# Altium schematic sheet [03] LCD.SchDoc
size A
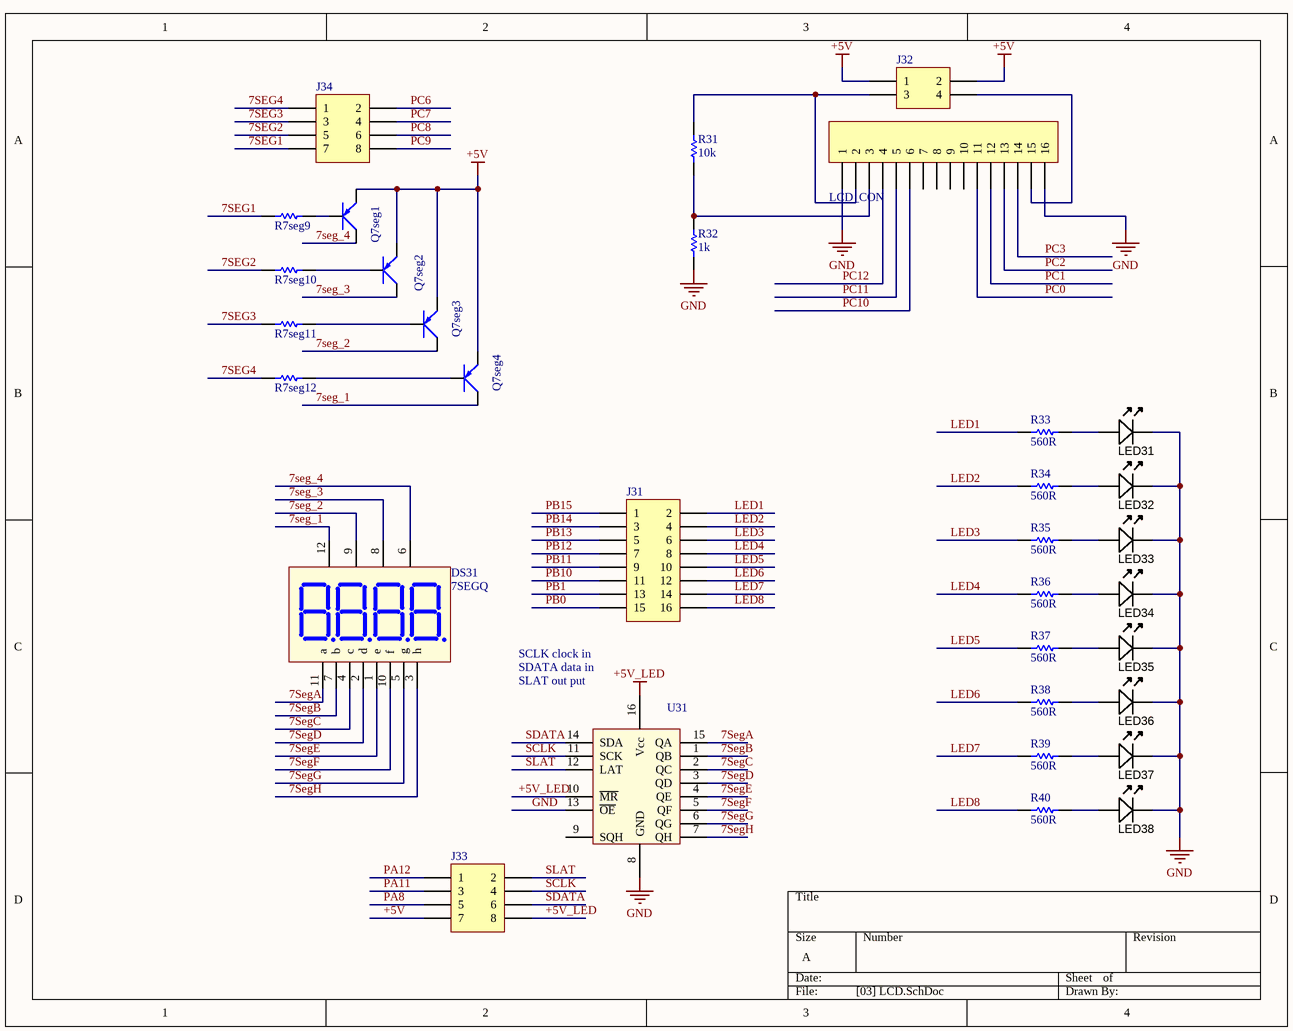
[diagram p0: [03] LCD.SchDoc]

## Parts
DS31  7SEGQ  [7segx4_small]
J31  Header 8X2  [HDR2X8]  (value not drawn)
J32  Header 2X2  [HDR2X2]  (value not drawn)
J33  Header 4X2  [HDR2X4]  (value not drawn)
J34  Header 4X2  [HDR2X4]  (value not drawn)
LCD_CON  Header 16  [HDR1X16]  (value not drawn)
LED31  Blue  [LED-0805-K]  (value not drawn)
LED32  Blue  [LED-0805-K]  (value not drawn)
LED33  Blue  [LED-0805-K]  (value not drawn)
LED34  Blue  [LED-0805-K]  (value not drawn)
LED35  Blue  [LED-0805-K]  (value not drawn)
LED36  Blue  [LED-0805-K]  (value not drawn)
LED37  Blue  [LED-0805-K]  (value not drawn)
LED38  Blue  [LED-0805-K]  (value not drawn)
Q7seg1  A1015  [SOT23B]  (value not drawn)
Q7seg2  A1015  [SOT23B]  (value not drawn)
Q7seg3  A1015  [SOT23B]  (value not drawn)
Q7seg4  A1015  [SOT23B]  (value not drawn)
R7seg9  Res  [RESC1608N_ZERO]  (value not drawn)
R7seg10  Res  [RESC1608N_ZERO]  (value not drawn)
R7seg11  Res  [RESC1608N_ZERO]  (value not drawn)
R7seg12  Res  [RESC1608N_ZERO]  (value not drawn)
R31  value 10k  [RESC1608N_ZERO]  (hidden comment: Res)
R32  value 1k  [RESC1608N_ZERO]  (hidden comment: Res)
R33  value 560R  [RESC1608N_ZERO]  (hidden comment: Res)
R34  value 560R  [RESC1608N_ZERO]  (hidden comment: Res)
R35  value 560R  [RESC1608N_ZERO]  (hidden comment: Res)
R36  value 560R  [RESC1608N_ZERO]  (hidden comment: Res)
R37  value 560R  [RESC1608N_ZERO]  (hidden comment: Res)
R38  value 560R  [RESC1608N_ZERO]  (hidden comment: Res)
R39  value 560R  [RESC1608N_ZERO]  (hidden comment: Res)
R40  value 560R  [RESC1608N_ZERO]  (hidden comment: Res)
U31  74HC595  [SOIC16]  (value not drawn)

## Nets
+5V: J32.1 J32.2 J33.7 Q7seg1.1(E) Q7seg2.1(E) Q7seg3.1(E) Q7seg4.1(E)
+5V_LED: J33.8 U31.10(~{MR}) U31.16(Vcc)
GND: LCD_CON.1 LCD_CON.16 LED31.K LED32.K LED33.K LED34.K LED35.K LED36.K LED37.K LED38.K R32.1 U31.8(GND) U31.13(~{OE})
7SEG1: J34.7 R7seg9.1
7SEG2: J34.5 R7seg10.1
7SEG3: J34.3 R7seg11.1
7SEG4: J34.1 R7seg12.1
7seg_1: DS31.12(V1) Q7seg4.2(C)
7seg_2: DS31.9(V2) Q7seg3.2(C)
7seg_3: DS31.8(V3) Q7seg2.2(C)
7seg_4: DS31.6(V4) Q7seg1.2(C)
7SegA: DS31.11(a) U31.15(QA)
7SegB: DS31.7(b) U31.1(QB)
7SegC: DS31.4(c) U31.2(QC)
7SegD: DS31.2(d) U31.3(QD)
7SegE: DS31.1(e) U31.4(QE)
7SegF: DS31.10(f) U31.5(QF)
7SegG: DS31.5(g) U31.6(QG)
7SegH: DS31.3(h) U31.7(QH)
LED1: J31.2 R33.1
LED2: J31.4 R34.1
LED3: J31.6 R35.1
LED4: J31.8 R36.1
LED5: J31.10 R37.1
LED6: J31.12 R38.1
LED7: J31.14 R39.1
LED8: J31.16 R40.1
PA8: J33.5
PA11: J33.3
PA12: J33.1
PB0: J31.15
PB1: J31.13
PB10: J31.11
PB11: J31.9
PB12: J31.7
PB13: J31.5
PB14: J31.3
PB15: J31.1
PC0: LCD_CON.11
PC1: LCD_CON.12
PC2: LCD_CON.13
PC3: LCD_CON.14
PC6: J34.2
PC7: J34.4
PC8: J34.6
PC9: J34.8
PC10: LCD_CON.6
PC11: LCD_CON.5
PC12: LCD_CON.4
SCLK: J33.4 U31.11(SCK)
SDATA: J33.6 U31.14(SDA)
SLAT: J33.2 U31.12(LAT)
NetJ32_3: J32.3 LCD_CON.2 R31.2
NetJ32_4: J32.4 LCD_CON.15
NetLCD_CON_3: LCD_CON.3 R31.1 R32.2
NetLED31_A: LED31.A R33.2
NetLED32_A: LED32.A R34.2
NetLED33_A: LED33.A R35.2
NetLED34_A: LED34.A R36.2
NetLED35_A: LED35.A R37.2
NetLED36_A: LED36.A R38.2
NetLED37_A: LED37.A R39.2
NetLED38_A: LED38.A R40.2
NetQ7seg1_3: Q7seg1.3(B) R7seg9.2
NetQ7seg2_3: Q7seg2.3(B) R7seg10.2
NetQ7seg3_3: Q7seg3.3(B) R7seg11.2
NetQ7seg4_3: Q7seg4.3(B) R7seg12.2

Not connected (* = marked no-connect by the designer): LCD_CON 7 8 9 10; U31 9(SQH)

## Notes on the sheet
- SCLK clock in
- SDATA data in
- (near U31) SLAT out put

## Library data of the parts
DS31 = LED7Q: Four 7 Seg Dipslay; Value: LED 7Q SEG
J31 = Header 8X2: Header, 8-Pin, Dual row; LatestRevisionDate: 17-Jul-2002; LatestRevisionNote: Re-released for DXP Platform.; Publisher: Altium Limited
J32 = Header 2X2: Header, 2-Pin, Dual row; LatestRevisionDate: 17-Jul-2002; LatestRevisionNote: Re-released for DXP Platform.; Publisher: Altium Limited
J33 J34 = Header 4X2: Header, 4-Pin, Dual row; LatestRevisionDate: 17-Jul-2002; LatestRevisionNote: Re-released for DXP Platform.; Publisher: Altium Limited
LCD_CON = Header 16: Header, 16-Pin; LatestRevisionDate: 17-Jul-2002; LatestRevisionNote: Re-released for DXP Platform.; Publisher: Altium Limited
LED31-LED38 = LED_SMD_Blue_0805_100mcd: LED 0805 SMD Blue 100mcd 470nm; Manufacturer 1: Ligitek; Manufacturer Part Number 1: LG-170DBKZ-CT; Material: InGaN/GaN; Ratings: 100 mcd; 470 nm; Package / Case: 0805; Value: Blue; Color: Blue
Q7seg1-Q7seg4 = A1015: PNP 600mW, ECB; Value: A1015
R7seg9 = Res: Value: 1K
R7seg10-R7seg12 = Res: Value: 220R